# Altium schematic sheet TMC7300.SchDoc
size A3
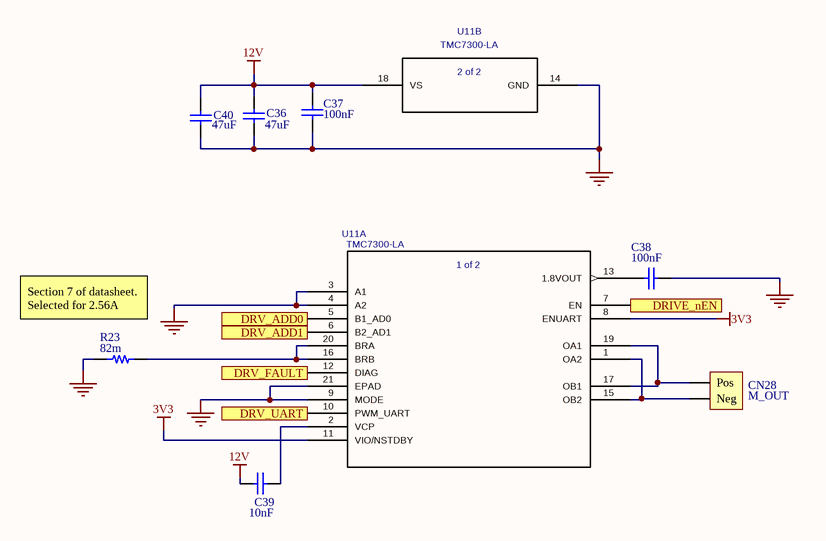
[diagram p0: TMC7300.SchDoc]

## Parts
C36  value 47uF  [1206]  (hidden comment: Cap)
C37  100nF  [0402]
C38  value 100nF  [0402]  (hidden comment: Cap)
C39  value 10nF  [0402]  (hidden comment: Cap)
C40  value 47uF  [1206]  (hidden comment: Cap)
CN28  M_OUT  [Power_Leads]
R23  82m  [2010_SMD_Resistor]
U11  TMC7300-LA  [QFN20_3X3]  (parts A,B of 2)

## Ports
DRIVE_nEN, DRV_ADD0, DRV_ADD1, DRV_FAULT, DRV_UART

## Nets
3V3: U11.8(ENUART) U11.11(VIO/NSTDBY)
12V: C36.2 C37.2 C39.1 C40.2 U11.18(VS)
GND: C36.1 C37.1 C38.2 C40.1 R23.1 U11.3(A1) U11.4(A2) U11.9(MODE) U11.14(GND) U11.21(EPAD)
DRIVE_nEN: U11.7(EN) ; port DRIVE_nEN
DRV_ADD0: U11.5(B1_AD0) ; port DRV_ADD0
DRV_ADD1: U11.6(B2_AD1) ; port DRV_ADD1
DRV_FAULT: U11.12(DIAG) ; port DRV_FAULT
DRV_UART: U11.10(PWM_UART) ; port DRV_UART
NetC38_1: C38.1 U11.13(1.8VOUT)
NetC39_2: C39.2 U11.2(VCP)
NetCN28_A: CN28.A(Pos) U11.17(OB1) U11.19(OA1)
NetCN28_K: CN28.K(Neg) U11.1(OA2) U11.15(OB2)
NetR23_2: R23.2 U11.16(BRB) U11.20(BRA)

## Notes on the sheet
- (near R23) Section 7 of datasheet. Selected for 2.56A
- (in symbol TMC7300-LA, part A) 1 of 2
- (in symbol TMC7300-LA, part B) 2 of 2

## Library data of the parts
C37 = Cap: Published: 8-Jun-2000; LatestRevisionDate: 17-Jul-2002; LatestRevisionNote: Re-released for DXP Platform.; PackageReference: RAD-0.3; Publisher: Altium Limited; PackageDescription: Radial Cap, Thru-Hole; 2 Leads; 0.3 in Pin Spacing; Value: 100nF
CN28 = JST_Leads_In
R23 = Resistor
U11 = TMC7300-LA: Vendor: Trinamic; Value: TMC7300-LA; Copyright: Copyright (C) 2018 Accelerated Designs. All rights reserved; Manufacturer_Part_Number: TMC7300-LA
C36 C38-C40 = Cap: Published: 8-Jun-2000; LatestRevisionDate: 17-Jul-2002; LatestRevisionNote: Re-released for DXP Platform.; PackageReference: RAD-0.3; Publisher: Altium Limited; PackageDescription: Radial Cap, Thru-Hole; 2 Leads; 0.3 in Pin Spacing